# Altium project AMSController.PrjPcb
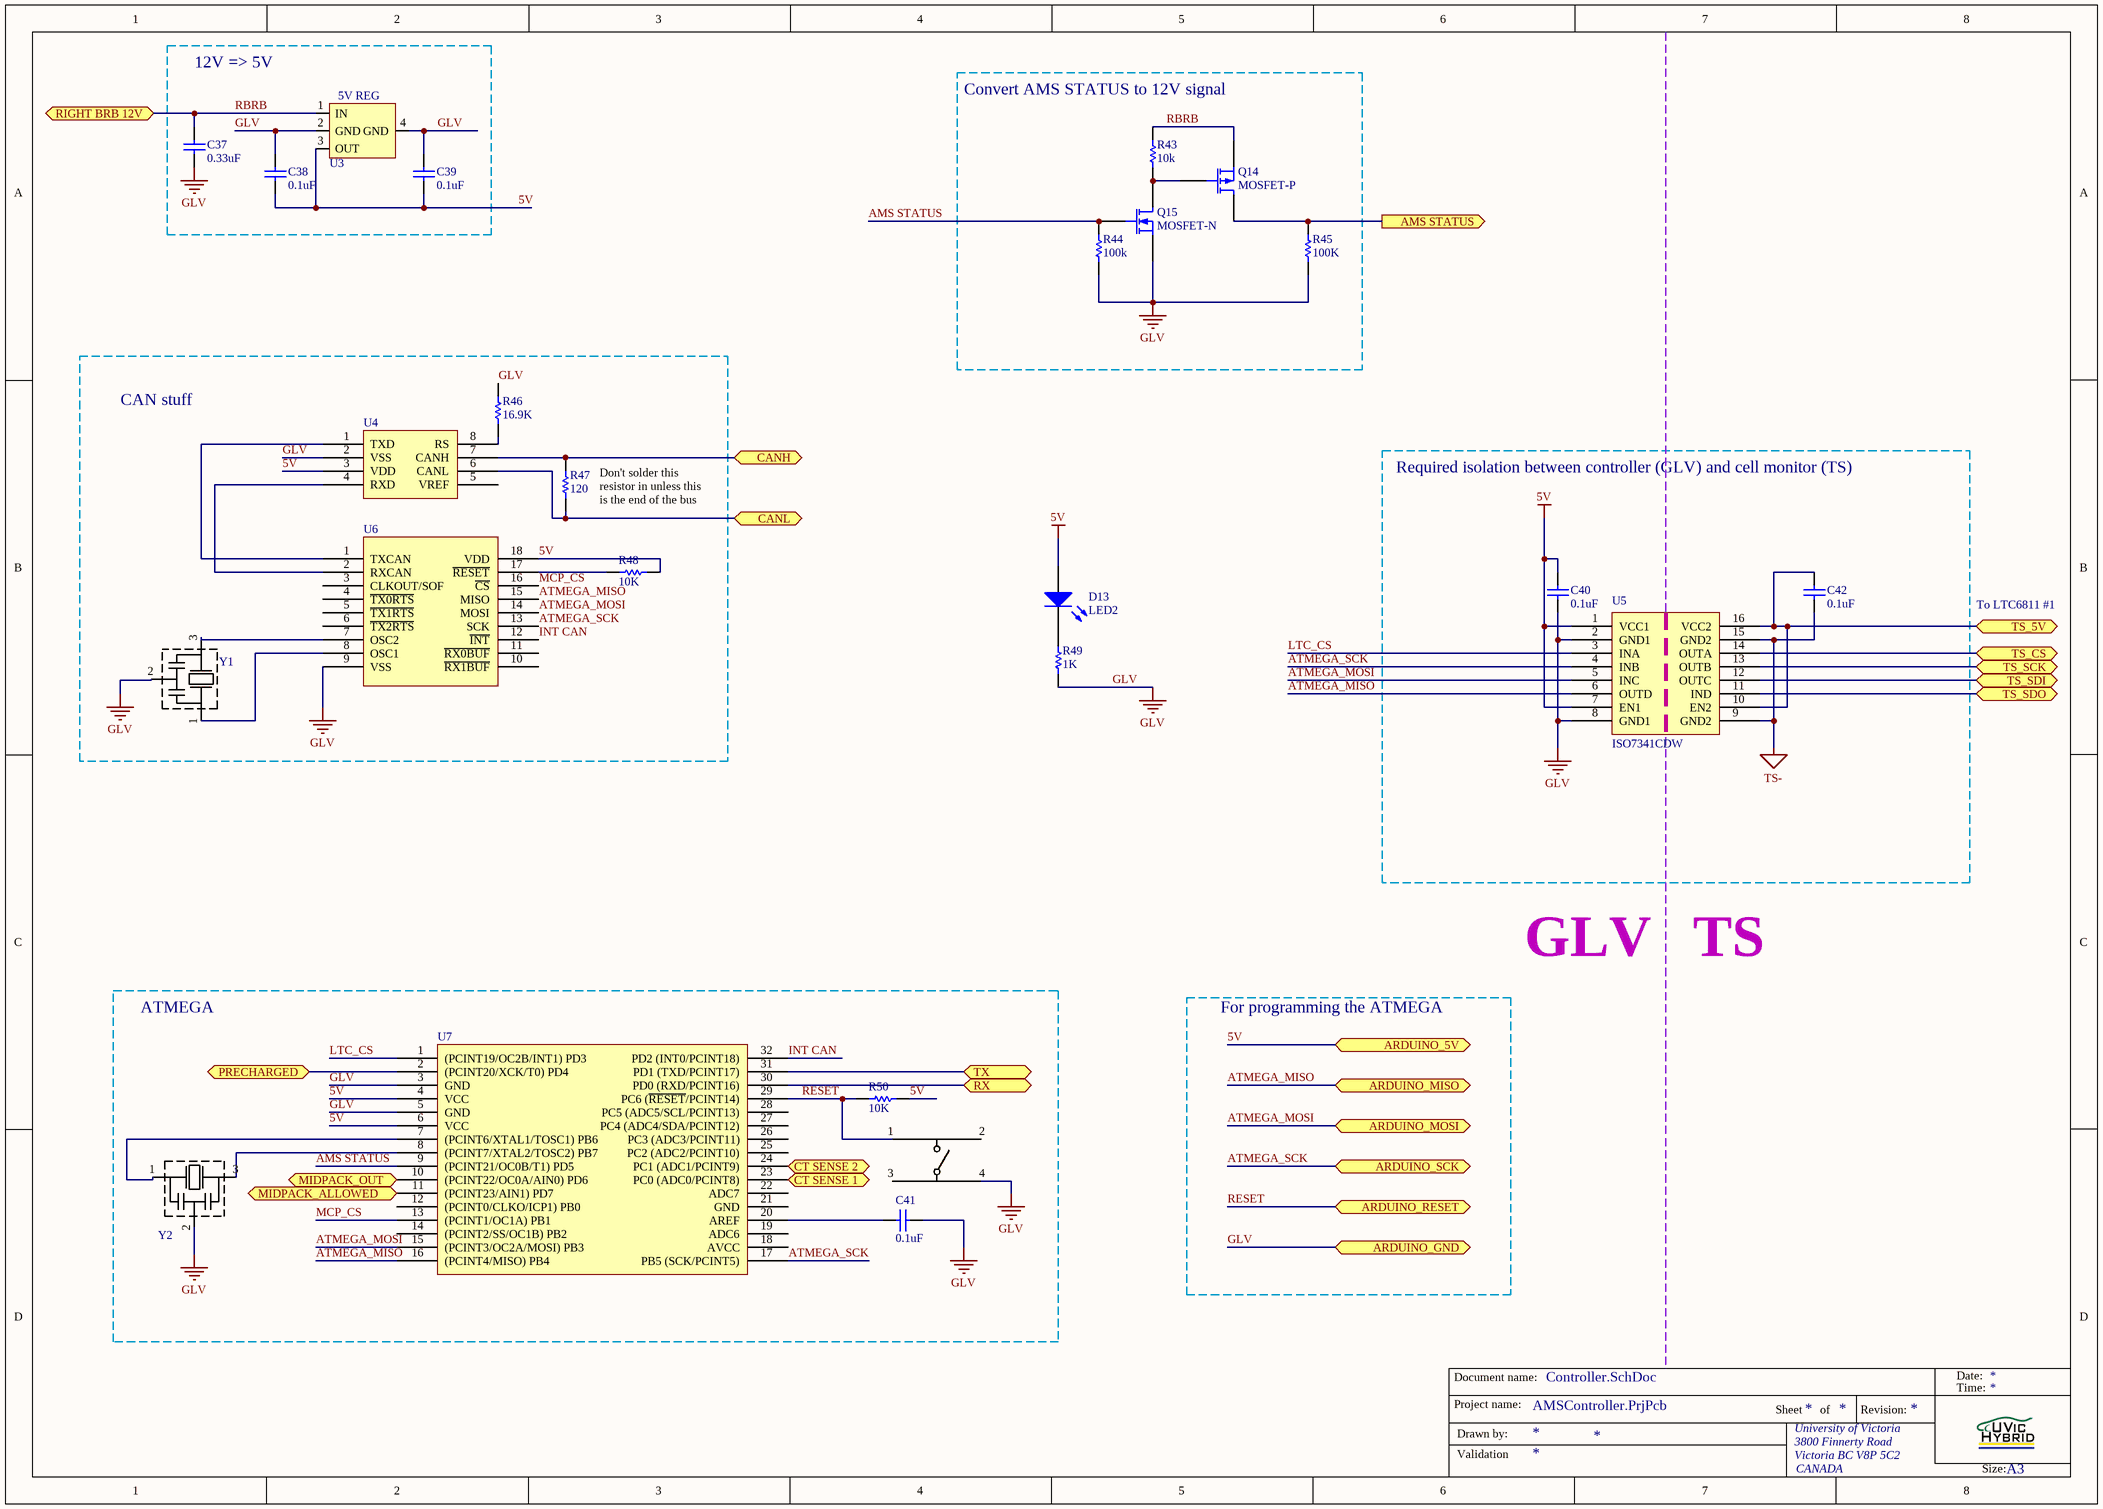
[diagram p0: Controller.SchDoc]
3 sheets, 151 parts. Net scope: flat (ports and power ports of the same name join across sheets).
Board file: AMSController.PcbDoc
Sheets:
  Controller.SchDoc
  IO.SchDoc
  CellMonitor1.SchDoc

## Sheet Controller.SchDoc
size A3

### Parts
C37  0.33uF  [C1206]
C38  0.1uF  [0603 IMPERIAL]
C39  0.1uF  [0603 IMPERIAL]
C40  0.1uF  [0603 IMPERIAL]
C41  0.1uF  [0603 IMPERIAL]
C42  0.1uF  [0603 IMPERIAL]
D13  LED2  [3.2X1.6X1.1]
Q14  MOSFET-P  [SOT23f]
Q15  MOSFET-N  [SOT23f]
R43  10k  [0603 IMPERIAL]
R44  100k  [0603 IMPERIAL]
R45  100K  [0603 IMPERIAL]
R46  16.9K  [0603 IMPERIAL]
R47  120  [0603 IMPERIAL]
R48  10K  [0603 IMPERIAL]
R49  1K  [0603 IMPERIAL]
R50  10K  [0603 IMPERIAL]
SW1  PTS525SM15SMTR2  [PTS525SM15SMTR2]  (value not drawn)
U3  UA7805CKTTR  [SOT223]  (value not drawn)
U4  MCP2551-E/SN  [SOIC127P600X175-8M]  (value not drawn)
U5  ISO7341CDW  [SOIC16-WB]
U6  MCP2515-E/ST  [SOIC127P1030X265-18M]  (value not drawn)
U7  ATMEGA328P  [ATMEGA328P-15AZ - 2]  (value not drawn)
Y1  CSTCE16M0V53-R0  [CSTCE16M0V53-R0]  (value not drawn)
Y2  CSTCE16M0V53-R0  [CSTCE16M0V53-R0]  (value not drawn)

### Blocks framed on the sheet
12V => 5V: C37-C39 U3
Convert AMS STATUS to 12V signal: Q14 Q15 R43-R45
CAN stuff: R46-R48 U4 U6 Y1
ATMEGA: C41 R50 SW1 U7 Y2

### Ports
AMS STATUS (out), ARDUINO_5V, ARDUINO_GND, ARDUINO_MISO, ARDUINO_MOSI, ARDUINO_RESET, ARDUINO_SCK, CANH, CANL, CT SENSE 1, CT SENSE 2, MIDPACK_ALLOWED, MIDPACK_OUT, PRECHARGED, RIGHT BRB 12V, RX, TS_5V, TS_CS, TS_SCK, TS_SDI, TS_SDO, TX

### Nets
5V: C38.1 C39.1 C40.2 D13.1(A) R48.2 R50.2 U3.3(OUT) U4.3(VDD) U5.1(VCC1) U5.7(EN1) U6.18(VDD) U7.4(VCC) U7.6(VCC) ; port ARDUINO_5V
GLV: C37.1 C38.2 C39.2 C40.1 C41.2 Q15.3(S) R44.1 R45.1 R46.2 R49.1 SW1.4 U3.2(GND) U3.4(GND) U4.2(VSS) U5.2(GND1) U5.8(GND1) U6.9(VSS) U7.3(GND) U7.5(GND) Y1.2 Y2.2 ; port ARDUINO_GND
TS-: C42.1 U5.9(GND2) U5.15(GND2)
AMS STATUS: Q15.2(G) R44.2 U7.9((PCINT21/OC0B/T1)_PD5)
ATMEGA_MISO: U5.6(OUTD) U6.15(MISO) U7.16((PCINT4/MISO)_PB4) ; port ARDUINO_MISO
ATMEGA_MOSI: U5.5(INC) U6.14(MOSI) U7.15((PCINT3/OC2A/MOSI)_PB3) ; port ARDUINO_MOSI
ATMEGA_SCK: U5.4(INB) U6.13(SCK) U7.17(PB5_(SCK/PCINT5)) ; port ARDUINO_SCK
CAN_N: R47.1 U4.6(CANL) ; port CANL
CAN_P: R47.2 U4.7(CANH) ; port CANH
CS: U5.14(OUTA) ; port TS_CS
INT CAN: U6.12(~{INT}) U7.32(PD2_(INT0/PCINT18))
LTC_CS: U5.3(INA) U7.1((PCINT19/OC2B/INT1)_PD3)
MCP_CS: U6.16(~{CS}) U7.13((PCINT1/OC1A)_PB1)
RBRB: C37.2 Q14.3(S) R43.2 U3.1(IN) ; port RIGHT BRB 12V
RESET: R50.1 SW1.1 U7.29(PC6_(~{RESET}/PCINT14)) ; port ARDUINO_RESET
SCK: U5.13(OUTB) ; port TS_SCK
SDI: U5.12(OUTC) ; port TS_SDI
SDO: U5.11(IND) ; port TS_SDO
TS_5V: C42.2 U5.10(EN2) U5.16(VCC2) ; port TS_5V
NetC41_1: C41.1 U7.20(AREF)
NetD13_2: D13.2(K) R49.2
NetP2_1: U7.2((PCINT20/XCK/T0)_PD4) ; port PRECHARGED
NetP2_2: U7.10((PCINT22/OC0A/AIN0)_PD6) ; port MIDPACK_OUT
NetP2_3: U7.11((PCINT23/AIN1)_PD7) ; port MIDPACK_ALLOWED
NetP6_6: U7.24(PC1_(ADC1/PCINT9)) ; port CT SENSE 2
NetP6_7: U7.23(PC0_(ADC0/PCINT8)) ; port CT SENSE 1
NetP6_10: Q14.1(D) R45.2 ; port AMS STATUS
NetP7_1: U7.31(PD1_(TXD/PCINT17)) ; port TX
NetP7_2: U7.30(PD0_(RXD/PCINT16)) ; port RX
NetQ14_2: Q14.2(G) Q15.1(D) R43.1
NetR46_1: R46.1 U4.8(RS)
NetR48_1: R48.1 U6.17(~{RESET})
NetU4_1: U4.1(TXD) U6.1(TXCAN)
NetU4_4: U4.4(RXD) U6.2(RXCAN)
NetU6_7: U6.7(OSC2) Y1.3
NetU6_8: U6.8(OSC1) Y1.1
NetU7_7: U7.7((PCINT6/XTAL1/TOSC1)_PB6) Y2.1
NetU7_8: U7.8((PCINT7/XTAL2/TOSC2)_PB7) Y2.3

Not connected (* = marked no-connect by the designer): SW1 2 3; U4 5(VREF); U6 3(CLKOUT/SOF) 4(~{TX0RTS}) 5(~{TX1RTS}) 6(~{TX2RTS}) 10(~{RX1BUF}) 11(~{RX0BUF}); U7 12((PCINT0/CLKO/ICP1)_PB0) 14((PCINT2/SS/OC1B)_PB2) 18(AVCC) 19(ADC6) 21(GND) 22(ADC7) 25(PC2_(ADC2/PCINT10)) 26(PC3_(ADC3/PCINT11)) 27(PC4_(ADC4/SDA/PCINT12)) 28(PC5_(ADC5/SCL/PCINT13))

### Notes on the sheet
- (near R47) Don't solder this resistor in unless this is the end of the bus
- Required isolation between controller (GLV) and cell monitor (TS)
- To LTC6811 #1
- GLV
- TS
- For programming the ATMEGA
- Document name:
- Date:
- Time:
- Project name:
- Drawn by:
- Validation
- Sheet
- University of Victoria
- 3800 Finnerty Road
- Victoria BC V8P 5C2
- of
- Revision:
- CANADA
- Size:
- A3
- (in symbol UA7805CKTTR) 5V REG

### Library data of the parts
C37 = Cap Semi: Capacitor (Semiconductor SIM Model); Published: 8-Jun-2000; LatestRevisionDate: 29-May-2009; LatestRevisionNote: IPC-7351 Footprint Added.; PackageReference: C1206; Publisher: Altium Limited; PackageDescription: Chip Capacitor; Value: 0.33uF; Supplier Part Number: 445-4464-1-ND
C38-C42 = Cap: Capacitor; Published: 8-Jun-2000; LatestRevisionDate: 17-Jul-2002; LatestRevisionNote: Re-released for DXP Platform.; Publisher: Altium Limited; Value: 0.1uF; Supplier Part Number: 399-1095-1-ND
D13 = LED2: Typical RED, GREEN, YELLOW, AMBER GaAs LED; Published: 8-Jun-2000; LatestRevisionDate: 17-Jul-2002; LatestRevisionNote: Re-released for DXP Platform.; PackageVersion: Feb-2002; PackageReference: 3.2X1.6X1.1; Publisher: Altium Limited; PackageDescription: SM LED; 2 Flat Leads; Supplier Part Number: 160-1456-1-ND
Q14 = MOSFET-P: P-Channel MOSFET; Published: 8-Jun-2000; LatestRevisionDate: 17-Jul-2002; LatestRevisionNote: Re-released for DXP Platform.; PackageVersion: 1995/1996; PackageReference: E3; Publisher: Altium Limited; PackageDescription: TO, Flat Index; 3 In-Line, Axial Leads; Body Dia. 4.6mm; Lead Dia. 0.5 mm (max); Supplier Part Number: BSS308PE H6327CT-ND
Q15 = MOSFET-N: N-Channel MOSFET; Published: 8-Jun-2000; LatestRevisionDate: 17-Jul-2002; LatestRevisionNote: Re-released for DXP Platform.; PackageVersion: 1995/1996; PackageReference: E3; Publisher: Altium Limited; PackageDescription: TO, Flat Index; 3 In-Line, Axial Leads; Body Dia. 4.6mm; Lead Dia. 0.5 mm (max); Supplier Part Number: DMN3404LDICT-ND
R43 R45-R50 = Res1: Resistor
  R43 R48 R50: Value: 10K; Supplier Part Number: MCT0603-10.0K-CFCT-ND
  R45: Value: 100K; Supplier Part Number: RR08P100KDCT-ND
  R46: Value: 16.9K; Supplier Part Number: P16.9KDBCT-ND
  R47: Value: 120; Supplier Part Number: 311-120HRCT-ND
  R49: Value: 1K; Supplier Part Number: 311-1.0KGRCT-ND
R44 = Res1: Resistor; Value: 10K; Supplier Part Number: RR08P100KDCT-ND
U3 = UA7805CKTTR: 12V to 5V LDO; Supplier Part Number: 296-12290-6-ND
U4 = MCP2551-E/SN: SOIC; Supplier Part Number: MCP2551-E/SN-ND
U6 = MCP2515-E/ST: SOIC; Supplier Part Number: MCP2515-I/SO-ND
U7 = ATMEGA328P: TQFN; Supplier 1: Digi-Key; Supplier Part Number: ATMEGA328P-AU-ND
SW1 = PTS525SM15SMTR2: Supplier 1: Digi-Key; Supplier Part Number: CKN9104CT-ND
Y1 Y2 = CSTCE16M0V53-R0: Supplier Part Number: 490-1198-1-ND

## Sheet IO.SchDoc
size A4
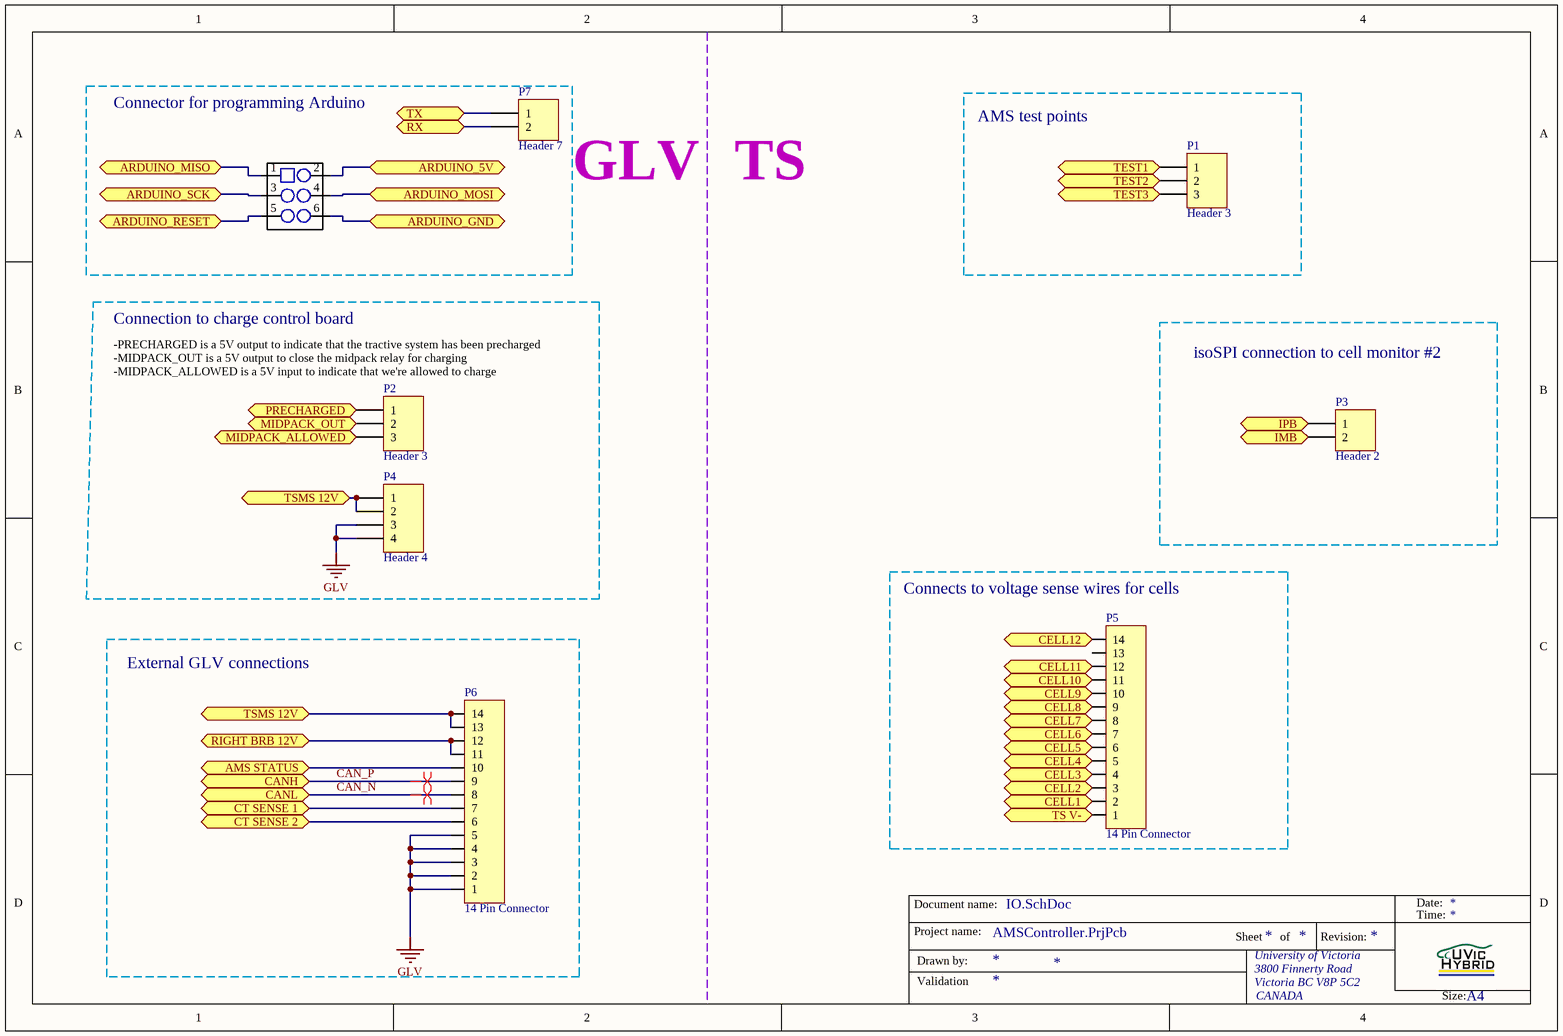
[diagram p1: IO.SchDoc]

### Parts
1  ICSP Connector  [ICSP Connector]  (value not drawn)
P1  Header 3  [3-pin Vertical nanofit]
P2  Header 3  [3-pin Vertical nanofit]
P3  Header 2  [2 Pin Nanofit]
P4  Header 4  [4 Pin Vertical Nanofit]
P5  14 Pin Connector  [TE Connectivity 14 Pin]
P6  14 Pin Connector  [TE Connectivity 14 Pin]
P7  Header 7  [2 Pin Nanofit]

### Blocks framed on the sheet
Connector for programming Arduino: 1 P7
AMS test points: P1
Connection to charge control board: P2 P4
isoSPI connection to cell monitor #2: P3
Connects to voltage sense wires for cells: P5
External GLV connections: P6

### Ports
AMS STATUS, ARDUINO_5V, ARDUINO_GND, ARDUINO_MISO, ARDUINO_MOSI, ARDUINO_RESET, ARDUINO_SCK, CANH, CANL, CELL1, CELL2, CELL3, CELL4, CELL5, CELL6, CELL7, CELL8, CELL9, CELL10, CELL11, CELL12, CT SENSE 1, CT SENSE 2, IMB, IPB, MIDPACK_ALLOWED, MIDPACK_OUT, PRECHARGED, RIGHT BRB 12V, RX, TEST1, TEST2, TEST3, TS V-, TSMS 12V, TX

### Nets
5V: 1.2 ; port ARDUINO_5V
GLV: 1.6 P4.3 P4.4 P6.1 P6.2 P6.3 P6.4 P6.5 ; port ARDUINO_GND
TS-: P5.1 ; port TS V-
ATMEGA_MISO: 1.1 ; port ARDUINO_MISO
ATMEGA_MOSI: 1.4 ; port ARDUINO_MOSI
ATMEGA_SCK: 1.3 ; port ARDUINO_SCK
CAN_N: P6.8 ; port CANL
CAN_P: P6.9 ; port CANH
RBRB: P6.11 P6.12 ; port RIGHT BRB 12V
RESET: 1.5 ; port ARDUINO_RESET
NetC3_2: P1.3 ; port TEST3
NetC5_2: P1.1 ; port TEST1
NetF1_1: P5.14 ; port CELL12
NetF2_1: P5.12 ; port CELL11
NetF3_1: P5.11 ; port CELL10
NetF4_1: P5.10 ; port CELL9
NetF5_1: P5.9 ; port CELL8
NetF6_1: P5.8 ; port CELL7
NetF7_1: P5.7 ; port CELL6
NetF8_1: P5.6 ; port CELL5
NetF9_1: P5.5 ; port CELL4
NetF10_1: P5.4 ; port CELL3
NetF11_1: P5.3 ; port CELL2
NetF12_1: P5.2 ; port CELL1
NetP1_2: P1.2 ; port TEST2
NetP2_1: P2.1 ; port PRECHARGED
NetP2_2: P2.2 ; port MIDPACK_OUT
NetP2_3: P2.3 ; port MIDPACK_ALLOWED
NetP3_1: P3.1 ; port IPB
NetP3_2: P3.2 ; port IMB
NetP4_1: P4.1 P4.2 P6.13 P6.14 ; port TSMS 12V
NetP6_6: P6.6 ; port CT SENSE 2
NetP6_7: P6.7 ; port CT SENSE 1
NetP6_10: P6.10 ; port AMS STATUS
NetP7_1: P7.1 ; port TX
NetP7_2: P7.2 ; port RX

Not connected (* = marked no-connect by the designer): P5 13

### Layout directives
differential pair: CAN_N, CAN_P

### Notes on the sheet
- GLV
- TS
- (near P2) -PRECHARGED is a 5V output to indicate that the tractive system has been precharged
  -MIDPACK_OUT is a 5V output to close the midpack relay for charging
  -MIDPACK_ALLOWED is a 5V input to indicate that we're allowed to charge
- Document name:
- Date:
- Time:
- Project name:
- Drawn by:
- Validation
- Sheet
- University of Victoria
- 3800 Finnerty Road
- Victoria BC V8P 5C2
- of
- Revision:
- CANADA
- Size:
- A4

### Library data of the parts
P1 P2 = Header 3: Header, 3-Pin; LatestRevisionDate: 17-Jul-2002; LatestRevisionNote: Re-released for DXP Platform.; Publisher: Altium Limited
P3 P7 = Header 2: Header, 2-Pin; LatestRevisionDate: 17-Jul-2002; LatestRevisionNote: Re-released for DXP Platform.; Publisher: Altium Limited
P4 = Header 4: Header, 4-Pin; LatestRevisionDate: 17-Jul-2002; LatestRevisionNote: Re-released for DXP Platform.; Publisher: Altium Limited
1 = ICSP Connector: Supplier Part Number: 952-2121-ND
P5 P6 = 14 Pin Connector: Supplier Part Number: A32482-ND

## Sheet CellMonitor1.SchDoc
size A2
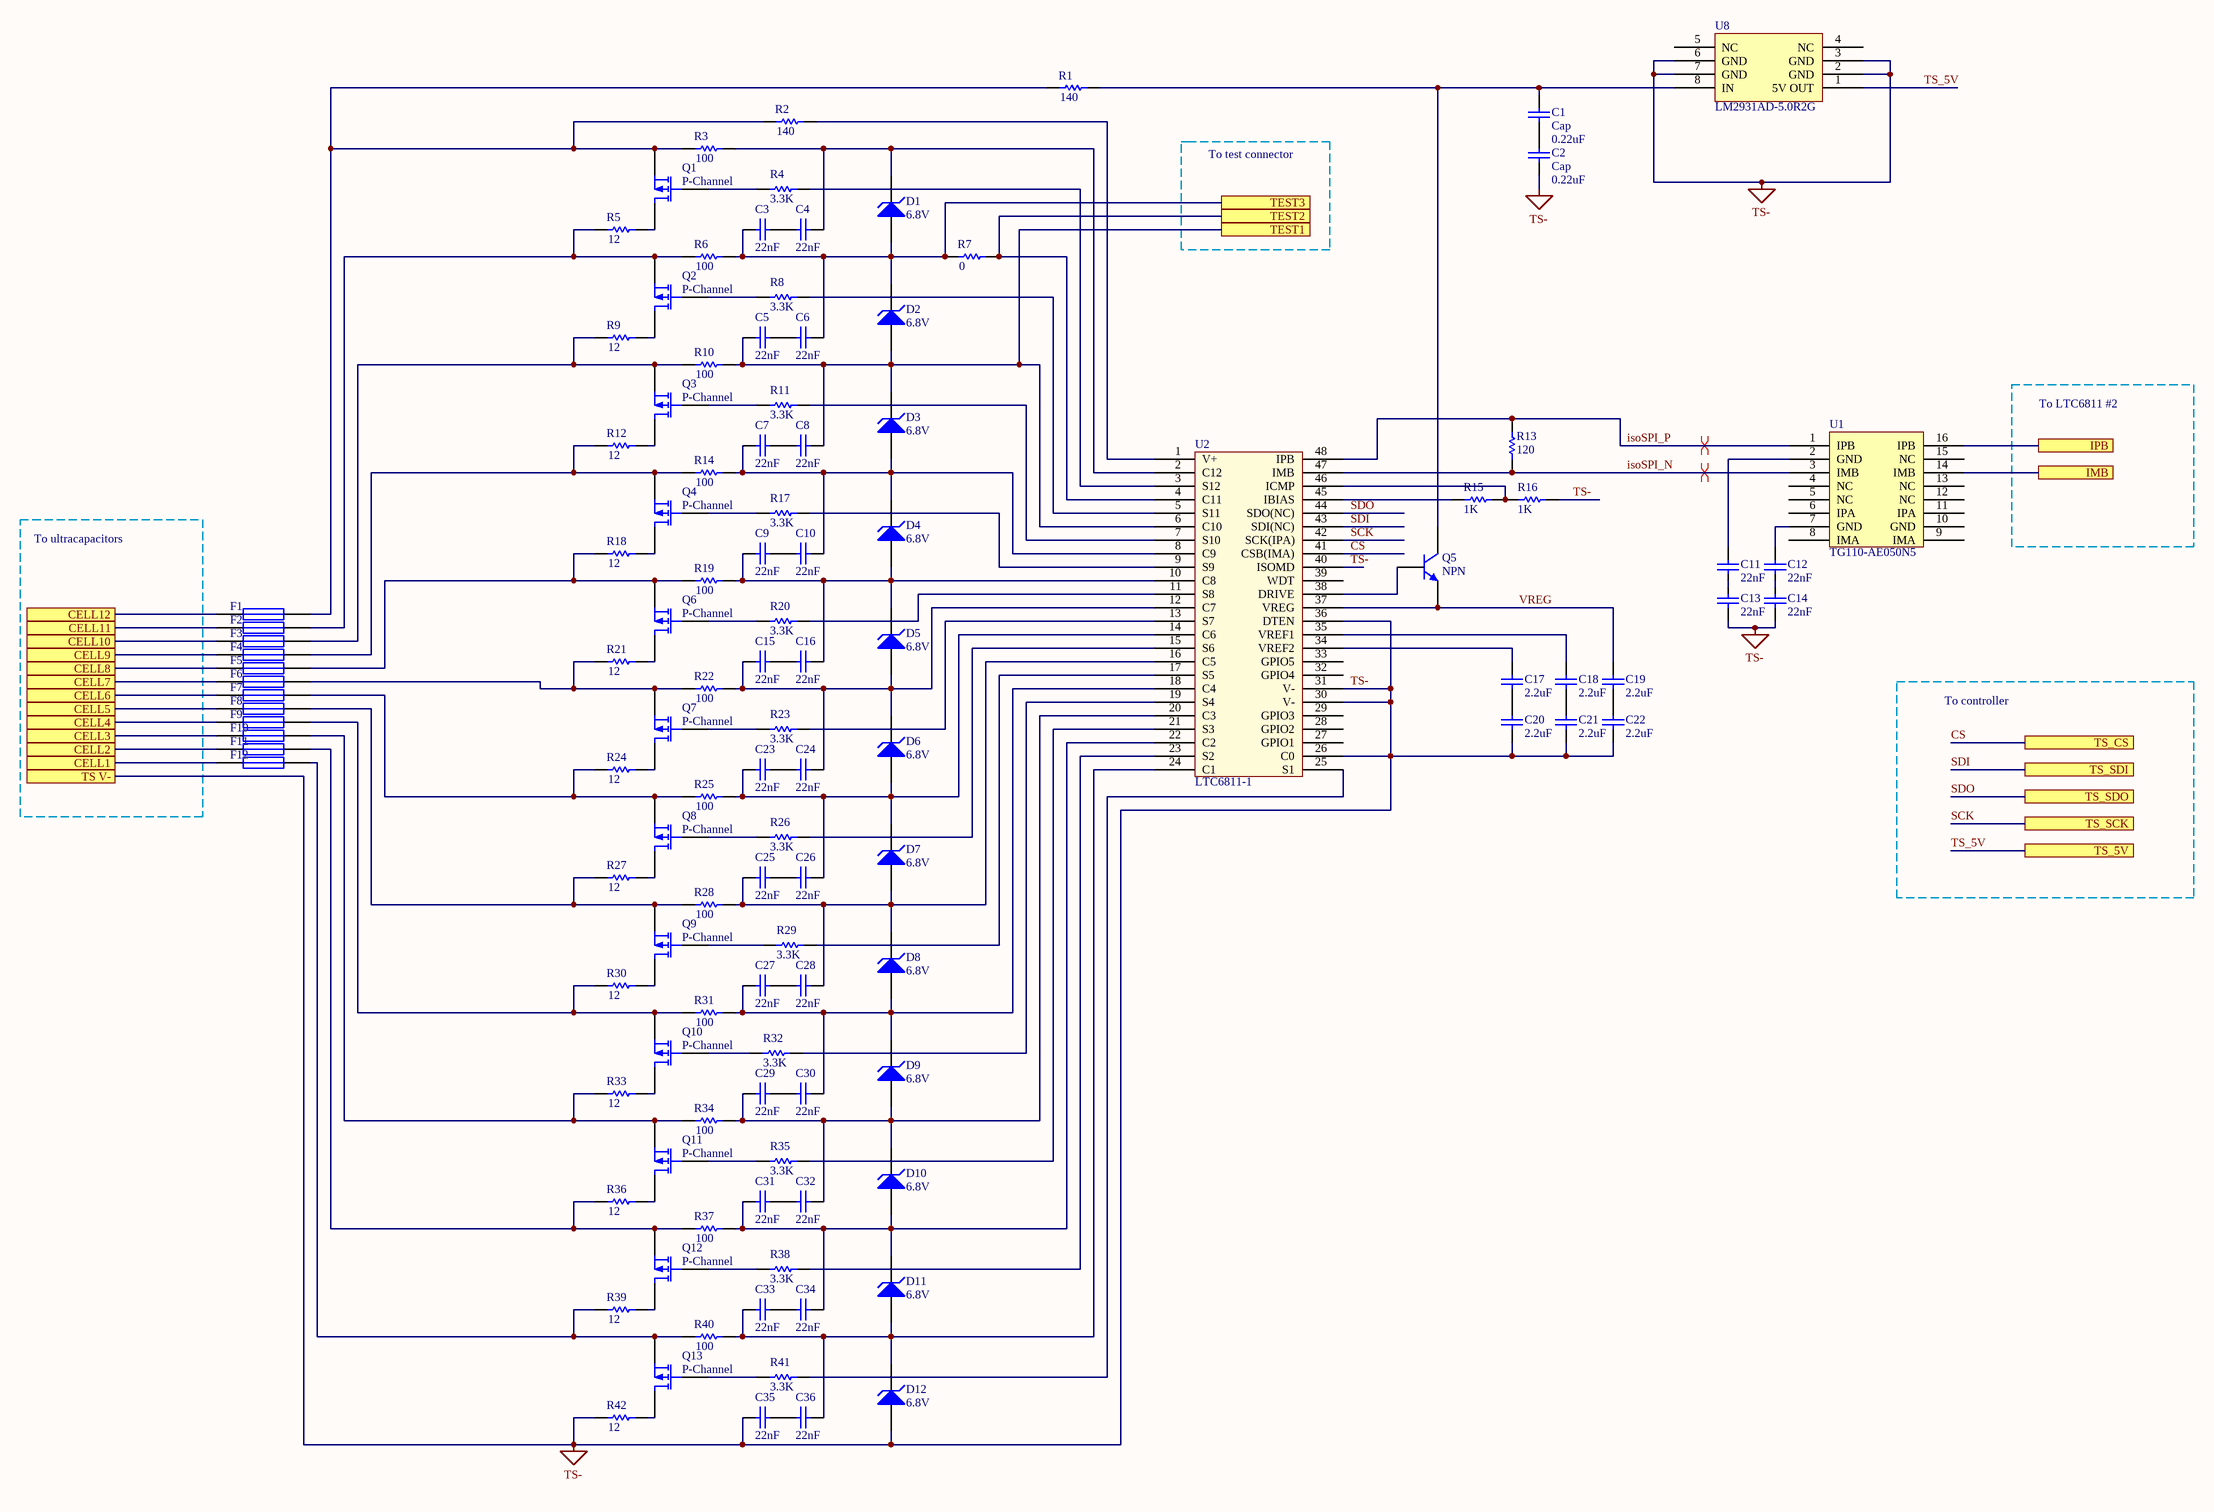
[diagram p2: CellMonitor1.SchDoc]

### Parts
C1  Cap  value 0.22uF  [0603 IMPERIAL]
C2  Cap  value 0.22uF  [0603 IMPERIAL]
C3  value 22nF  [0603 IMPERIAL]  (hidden comment: Cap)
C4  value 22nF  [0603 IMPERIAL]  (hidden comment: Cap)
C5  value 22nF  [0603 IMPERIAL]  (hidden comment: Cap)
C6  value 22nF  [0603 IMPERIAL]  (hidden comment: Cap)
C7  value 22nF  [0603 IMPERIAL]  (hidden comment: Cap)
C8  value 22nF  [0603 IMPERIAL]  (hidden comment: Cap)
C9  value 22nF  [0603 IMPERIAL]  (hidden comment: Cap)
C10  value 22nF  [0603 IMPERIAL]  (hidden comment: Cap)
C11  value 22nF  [0603 IMPERIAL]  (hidden comment: Cap)
C12  value 22nF  [0603 IMPERIAL]  (hidden comment: Cap)
C13  value 22nF  [0603 IMPERIAL]  (hidden comment: Cap)
C14  value 22nF  [0603 IMPERIAL]  (hidden comment: Cap)
C15  value 22nF  [0603 IMPERIAL]  (hidden comment: Cap)
C16  value 22nF  [0603 IMPERIAL]  (hidden comment: Cap)
C17  value 2.2uF  [0603 IMPERIAL]  (hidden comment: Cap)
C18  value 2.2uF  [0603 IMPERIAL]  (hidden comment: Cap)
C19  value 2.2uF  [0603 IMPERIAL]  (hidden comment: Cap)
C20  value 2.2uF  [0603 IMPERIAL]  (hidden comment: Cap)
C21  value 2.2uF  [0603 IMPERIAL]  (hidden comment: Cap)
C22  value 2.2uF  [0603 IMPERIAL]  (hidden comment: Cap)
C23  value 22nF  [0603 IMPERIAL]  (hidden comment: Cap)
C24  value 22nF  [0603 IMPERIAL]  (hidden comment: Cap)
C25  value 22nF  [0603 IMPERIAL]  (hidden comment: Cap)
C26  value 22nF  [0603 IMPERIAL]  (hidden comment: Cap)
C27  value 22nF  [0603 IMPERIAL]  (hidden comment: Cap)
C28  value 22nF  [0603 IMPERIAL]  (hidden comment: Cap)
C29  value 22nF  [0603 IMPERIAL]  (hidden comment: Cap)
C30  value 22nF  [0603 IMPERIAL]  (hidden comment: Cap)
C31  value 22nF  [0603 IMPERIAL]  (hidden comment: Cap)
C32  value 22nF  [0603 IMPERIAL]  (hidden comment: Cap)
C33  value 22nF  [0603 IMPERIAL]  (hidden comment: Cap)
C34  value 22nF  [0603 IMPERIAL]  (hidden comment: Cap)
C35  value 22nF  [0603 IMPERIAL]  (hidden comment: Cap)
C36  value 22nF  [0603 IMPERIAL]  (hidden comment: Cap)
D1  6.8V  [SOD-323]
D2  6.8V  [SOD-323]
D3  6.8V  [SOD-323]
D4  6.8V  [SOD-323]
D5  6.8V  [SOD-323]
D6  6.8V  [SOD-323]
D7  6.8V  [SOD-323]
D8  6.8V  [SOD-323]
D9  6.8V  [SOD-323]
D10  6.8V  [SOD-323]
D11  6.8V  [SOD-323]
D12  6.8V  [SOD-323]
F1  0451.500NRL  [0451.500NRL]  (value not drawn)
F2  0451.500NRL  [0451.500NRL]  (value not drawn)
F3  0451.500NRL  [0451.500NRL]  (value not drawn)
F4  0451.500NRL  [0451.500NRL]  (value not drawn)
F5  0451.500NRL  [0451.500NRL]  (value not drawn)
F6  0451.500NRL  [0451.500NRL]  (value not drawn)
F7  0451.500NRL  [0451.500NRL]  (value not drawn)
F8  0451.500NRL  [0451.500NRL]  (value not drawn)
F9  0451.500NRL  [0451.500NRL]  (value not drawn)
F10  0451.500NRL  [0451.500NRL]  (value not drawn)
F11  0451.500NRL  [0451.500NRL]  (value not drawn)
F12  0451.500NRL  [0451.500NRL]  (value not drawn)
Q1  P-Channel  [SOT23F]
Q2  P-Channel  [SOT23F]
Q3  P-Channel  [SOT23F]
Q4  P-Channel  [SOT23F]
Q5  NPN  [SOT223_N]
Q6  P-Channel  [SOT23F]
Q7  P-Channel  [SOT23F]
Q8  P-Channel  [SOT23F]
Q9  P-Channel  [SOT23F]
Q10  P-Channel  [SOT23F]
Q11  P-Channel  [SOT23F]
Q12  P-Channel  [SOT23F]
Q13  P-Channel  [SOT23F]
R1  value 140  [0603 IMPERIAL]  (hidden comment: Res1)
R2  value 140  [0603 IMPERIAL]  (hidden comment: Res1)
R3  value 100  [0603 IMPERIAL]  (hidden comment: Res1)
R4  value 3.3K  [0603 IMPERIAL]  (hidden comment: Res1)
R5  value 12  [2512 IMPERIAL]  (hidden comment: Res1)
R6  value 100  [0603 IMPERIAL]  (hidden comment: Res1)
R7  value 0  [0603 IMPERIAL]  (hidden comment: Res1)
R8  value 3.3K  [0603 IMPERIAL]  (hidden comment: Res1)
R9  value 12  [2512 IMPERIAL]  (hidden comment: Res1)
R10  value 100  [0603 IMPERIAL]  (hidden comment: Res1)
R11  value 3.3K  [0603 IMPERIAL]  (hidden comment: Res1)
R12  value 12  [2512 IMPERIAL]  (hidden comment: Res1)
R13  120  [0603 IMPERIAL]
R14  value 100  [0603 IMPERIAL]  (hidden comment: Res1)
R15  1K  [0603 IMPERIAL]
R16  1K  [0603 IMPERIAL]
R17  value 3.3K  [0603 IMPERIAL]  (hidden comment: Res1)
R18  value 12  [2512 IMPERIAL]  (hidden comment: Res1)
R19  value 100  [0603 IMPERIAL]  (hidden comment: Res1)
R20  value 3.3K  [0603 IMPERIAL]  (hidden comment: Res1)
R21  value 12  [2512 IMPERIAL]  (hidden comment: Res1)
R22  value 100  [0603 IMPERIAL]  (hidden comment: Res1)
R23  value 3.3K  [0603 IMPERIAL]  (hidden comment: Res1)
R24  value 12  [2512 IMPERIAL]  (hidden comment: Res1)
R25  value 100  [0603 IMPERIAL]  (hidden comment: Res1)
R26  value 3.3K  [0603 IMPERIAL]  (hidden comment: Res1)
R27  value 12  [2512 IMPERIAL]  (hidden comment: Res1)
R28  value 100  [0603 IMPERIAL]  (hidden comment: Res1)
R29  value 3.3K  [0603 IMPERIAL]  (hidden comment: Res1)
R30  value 12  [2512 IMPERIAL]  (hidden comment: Res1)
R31  value 100  [0603 IMPERIAL]  (hidden comment: Res1)
R32  value 3.3K  [0603 IMPERIAL]  (hidden comment: Res1)
R33  value 12  [2512 IMPERIAL]  (hidden comment: Res1)
R34  value 100  [0603 IMPERIAL]  (hidden comment: Res1)
R35  value 3.3K  [0603 IMPERIAL]  (hidden comment: Res1)
R36  value 12  [2512 IMPERIAL]  (hidden comment: Res1)
R37  value 100  [0603 IMPERIAL]  (hidden comment: Res1)
R38  value 3.3K  [0603 IMPERIAL]  (hidden comment: Res1)
R39  value 12  [2512 IMPERIAL]  (hidden comment: Res1)
R40  value 100  [0603 IMPERIAL]  (hidden comment: Res1)
R41  value 3.3K  [0603 IMPERIAL]  (hidden comment: Res1)
R42  value 12  [2512 IMPERIAL]  (hidden comment: Res1)
U1  TG110-AE050N5  [Halo N5]
U2  LTC6811-1  [SSOP-48]
U8  LM2931AD-5.0R2G  [8-SOIC]

### Ports
CELL1, CELL2, CELL3, CELL4, CELL5, CELL6, CELL7, CELL8, CELL9, CELL10, CELL11, CELL12, IMB, IPB, TEST1, TEST2, TEST3, TS V-, TS_5V, TS_CS, TS_SCK, TS_SDI, TS_SDO

### Nets
TS-: C2.2 C13.2 C14.2 C20.2 C21.2 C22.2 C35.2 D12.1(A) R16.2 R42.1 U2.26(C0) U2.30(V-) U2.31(V-) U2.36(DTEN) U2.40(ISOMD) U8.2(GND) U8.3(GND) U8.6(GND) U8.7(GND) ; port TS V-
CS: U2.41(CSB(IMA)) ; port TS_CS
isoSPI_N: R13.1 U1.3(IMB) U2.47(IMB)
isoSPI_P: R13.2 U1.1(IPB) U2.48(IPB)
SCK: U2.42(SCK(IPA)) ; port TS_SCK
SDI: U2.43(SDI(NC)) ; port TS_SDI
SDO: U2.44(SDO(NC)) ; port TS_SDO
TS_5V: U8.1(5V_OUT) ; port TS_5V
VREG: C19.1 Q5.3(E) U2.37(VREG)
NetC1_1: C1.1 Q5.2(C) R1.2 U8.8(IN)
NetC1_2: C1.2 C2.1
NetC3_1: C3.1 C4.2
NetC3_2: C3.2 C6.1 D1.1(A) D2.2(K) R6.2 R7.1 ; port TEST3
NetC4_1: C4.1 D1.2(K) R3.2 U2.2(C12)
NetC5_1: C5.1 C6.2
NetC5_2: C5.2 C8.1 D2.1(A) D3.2(K) R10.2 U2.6(C10) ; port TEST1
NetC7_1: C7.1 C8.2
NetC7_2: C7.2 C10.1 D3.1(A) D4.2(K) R14.2 U2.8(C9)
NetC9_1: C9.1 C10.2
NetC9_2: C9.2 C16.1 D4.1(A) D5.2(K) R19.2 U2.10(C8)
NetC11_1: C11.1 U1.2(GND)
NetC11_2: C11.2 C13.1
NetC12_1: C12.1 U1.7(GND)
NetC12_2: C12.2 C14.1
NetC15_1: C15.1 C16.2
NetC15_2: C15.2 C24.1 D5.1(A) D6.2(K) R22.2 U2.12(C7)
NetC17_1: C17.1 U2.34(VREF2)
NetC17_2: C17.2 C20.1
NetC18_1: C18.1 U2.35(VREF1)
NetC18_2: C18.2 C21.1
NetC19_2: C19.2 C22.1
NetC23_1: C23.1 C24.2
NetC23_2: C23.2 C26.1 D6.1(A) D7.2(K) R25.2 U2.14(C6)
NetC25_1: C25.1 C26.2
NetC25_2: C25.2 C28.1 D7.1(A) D8.2(K) R28.2 U2.16(C5)
NetC27_1: C27.1 C28.2
NetC27_2: C27.2 C30.1 D8.1(A) D9.2(K) R31.2 U2.18(C4)
NetC29_1: C29.1 C30.2
NetC29_2: C29.2 C32.1 D9.1(A) D10.2(K) R34.2 U2.20(C3)
NetC31_1: C31.1 C32.2
NetC31_2: C31.2 C34.1 D10.1(A) D11.2(K) R37.2 U2.22(C2)
NetC33_1: C33.1 C34.2
NetC33_2: C33.2 C36.1 D11.1(A) D12.2(K) R40.2 U2.24(C1)
NetC35_1: C35.1 C36.2
NetF1_1: F1.1 ; port CELL12
NetF1_2: F1.2 Q1.3(S) R1.1 R2.1 R3.1
NetF2_1: F2.1 ; port CELL11
NetF2_2: F2.2 Q2.3(S) R5.1 R6.1
NetF3_1: F3.1 ; port CELL10
NetF3_2: F3.2 Q3.3(S) R9.1 R10.1
NetF4_1: F4.1 ; port CELL9
NetF4_2: F4.2 Q4.3(S) R12.1 R14.1
NetF5_1: F5.1 ; port CELL8
NetF5_2: F5.2 Q6.3(S) R18.1 R19.1
NetF6_1: F6.1 ; port CELL7
NetF6_2: F6.2 Q7.3(S) R21.1 R22.1
NetF7_1: F7.1 ; port CELL6
NetF7_2: F7.2 Q8.3(S) R24.1 R25.1
NetF8_1: F8.1 ; port CELL5
NetF8_2: F8.2 Q9.3(S) R27.1 R28.1
NetF9_1: F9.1 ; port CELL4
NetF9_2: F9.2 Q10.3(S) R30.1 R31.1
NetF10_1: F10.1 ; port CELL3
NetF10_2: F10.2 Q11.3(S) R33.1 R34.1
NetF11_1: F11.1 ; port CELL2
NetF11_2: F11.2 Q12.3(S) R36.1 R37.1
NetF12_1: F12.1 ; port CELL1
NetF12_2: F12.2 Q13.3(S) R39.1 R40.1
NetP1_2: R7.2 U2.4(C11) ; port TEST2
NetP3_1: U1.16(IPB) ; port IPB
NetP3_2: U1.14(IMB) ; port IMB
NetQ1_1: Q1.1(D) R5.2
NetQ1_2: Q1.2(G) R4.1
NetQ2_1: Q2.1(D) R9.2
NetQ2_2: Q2.2(G) R8.1
NetQ3_1: Q3.1(D) R12.2
NetQ3_2: Q3.2(G) R11.1
NetQ4_1: Q4.1(D) R18.2
NetQ4_2: Q4.2(G) R17.1
NetQ5_1: Q5.1(B) U2.38(DRIVE)
NetQ6_1: Q6.1(D) R21.2
NetQ6_2: Q6.2(G) R20.1
NetQ7_1: Q7.1(D) R24.2
NetQ7_2: Q7.2(G) R23.1
NetQ8_1: Q8.1(D) R27.2
NetQ8_2: Q8.2(G) R26.1
NetQ9_1: Q9.1(D) R30.2
NetQ9_2: Q9.2(G) R29.1
NetQ10_1: Q10.1(D) R33.2
NetQ10_2: Q10.2(G) R32.1
NetQ11_1: Q11.1(D) R36.2
NetQ11_2: Q11.2(G) R35.1
NetQ12_1: Q12.1(D) R39.2
NetQ12_2: Q12.2(G) R38.1
NetQ13_1: Q13.1(D) R42.2
NetQ13_2: Q13.2(G) R41.1
NetR2_2: R2.2 U2.1(V+)
NetR4_2: R4.2 U2.3(S12)
NetR8_2: R8.2 U2.5(S11)
NetR11_2: R11.2 U2.7(S10)
NetR15_1: R15.1 U2.45(IBIAS)
NetR15_2: R15.2 R16.1 U2.46(ICMP)
NetR17_2: R17.2 U2.9(S9)
NetR20_2: R20.2 U2.11(S8)
NetR23_2: R23.2 U2.13(S7)
NetR26_2: R26.2 U2.15(S6)
NetR29_2: R29.2 U2.17(S5)
NetR32_2: R32.2 U2.19(S4)
NetR35_2: R35.2 U2.21(S3)
NetR38_2: R38.2 U2.23(S2)
NetR41_2: R41.2 U2.25(S1)

Not connected (* = marked no-connect by the designer): U1 4(NC) 5(NC) 6(IPA) 8(IMA) 9(IMA) 10(GND) 11(IPA) 12(NC) 13(NC) 15(NC); U2 27(GPIO1) 28(GPIO2) 29(GPIO3) 32(GPIO4) 33(GPIO5) 39(WDT); U8 4(NC) 5(NC)

### Layout directives
differential pair: isoSPI_N, isoSPI_P

### Notes on the sheet
- To test connector
- To LTC6811 #2
- To ultracapacitors
- To controller
- Document name:
- Project name:
- Date:
- Time:
- Drawn by:
- Validation
- Sheet
- University of Victoria
- 3800 Finnerty Road
- Victoria BC V8P 5C2
- CANADA
- of
- Revision:
- Size:
- A2

### Library data of the parts
C1-C36 = Cap: Capacitor; Published: 8-Jun-2000; LatestRevisionDate: 17-Jul-2002; LatestRevisionNote: Re-released for DXP Platform.; PackageReference: RAD-0.3; Publisher: Altium Limited; PackageDescription: Radial Cap, Thru-Hole; 2 Leads; 0.3 in Pin Spacing
  C1 C2: Supplier Part Number: 490-5402-1-ND
  C3-C16 C23-C36: Supplier Part Number: 399-3476-1-ND
  C17-C22: Supplier Part Number: 490-3296-1-ND
D1-D12 = D Zener: Zener Diode; Published: 8-Jun-2000; LatestRevisionDate: 17-Jul-2002; LatestRevisionNote: Re-released for DXP Platform.; PackageReference: DIODE-0.7; Publisher: Altium Limited; PackageDescription: Diode, Thru-Hole; 2 Leads; 0.7 in Pin Spacing; Supplier Part Number: 568-6455-1-ND
F1-F12 = Fuse 1: Fuse; Published: 8-Jun-2000; LatestRevisionDate: 17-Jul-2002; LatestRevisionNote: Re-released for DXP Platform.; PackageReference: PIN-W2/E2.8; Publisher: Altium Limited
  F1 F2 F5-F9 F11: Supplier Part Number: F5964CT-ND
Q1-Q4 Q6-Q13 = MOSFET-P: P-Channel MOSFET; Published: 8-Jun-2000; LatestRevisionDate: 17-Jul-2002; LatestRevisionNote: Re-released for DXP Platform.; PackageVersion: 1995/1996; PackageReference: E3; Publisher: Altium Limited; PackageDescription: TO, Flat Index; 3 In-Line, Axial Leads; Body Dia. 4.6mm; Lead Dia. 0.5 mm (max); Supplier Part Number: BSS308PE H6327CT-ND
Q5 = 2N3904: NPN General Purpose Amplifier; Published: 8-Jun-2000; LatestRevisionDate: 15-Jan-2003; LatestRevisionNote: PCB Footprint 'BCY-W3/D4.7' replaced; DatasheetVersion: 1997; PackageVersion: Sep-1998; PackageReference: TO-92A; Publisher: Altium Limited; PackageDescription: TO, Flat Index; 3 In-Line, Axial Leads; Body Dia. 4.5mm; Leads 0.51 x 0.48 mm (max); ComponentLink1Description: Manufacturer Link; ComponentLink1URL: http://www.fairchildsemi.com/; ComponentLink2Description: Datasheet; ComponentLink2URL: http://www.fairchildsemi.com/ds/2N%2F2N3904.pdf; Supplier Part Number: NSV1C201MZ4T1GOSCT-ND
R1-R42 = Res1: Resistor
  R1 R2: Published: 8-Jun-2000; LatestRevisionDate: 17-Jul-2002; LatestRevisionNote: Re-released for DXP Platform.; PackageReference: AXIAL-0.3; Publisher: Altium Limited; PackageDescription: Axial Device, Thru-Hole; 2 Leads; 0.3 in Pin Spacing; Supplier Part Number: P140HCT-ND
  R3 R6 R10 R14 R19 R22 R25 R28 R31 R34 R37 R40: Published: 8-Jun-2000; LatestRevisionDate: 17-Jul-2002; LatestRevisionNote: Re-released for DXP Platform.; PackageReference: AXIAL-0.3; Publisher: Altium Limited; PackageDescription: Axial Device, Thru-Hole; 2 Leads; 0.3 in Pin Spacing; Supplier Part Number: 311-100HRCT-ND
  R4 R8 R11 R17 R20 R23 R26 R29 R32 R35 R38 R41: Published: 8-Jun-2000; LatestRevisionDate: 17-Jul-2002; LatestRevisionNote: Re-released for DXP Platform.; PackageReference: AXIAL-0.3; Publisher: Altium Limited; PackageDescription: Axial Device, Thru-Hole; 2 Leads; 0.3 in Pin Spacing; Supplier Part Number: 311-3.30KHRCT-ND
  R5 R9 R12 R18 R21 R24 R27 R30 R33 R36 R39 R42: Published: 8-Jun-2000; LatestRevisionDate: 17-Jul-2002; LatestRevisionNote: Re-released for DXP Platform.; PackageReference: AXIAL-0.3; Publisher: Altium Limited; PackageDescription: Axial Device, Thru-Hole; 2 Leads; 0.3 in Pin Spacing; Supplier Part Number: RMCF2512FT12R0CT-ND
  R7: Published: 8-Jun-2000; LatestRevisionDate: 17-Jul-2002; LatestRevisionNote: Re-released for DXP Platform.; PackageReference: AXIAL-0.3; Publisher: Altium Limited; PackageDescription: Axial Device, Thru-Hole; 2 Leads; 0.3 in Pin Spacing; Supplier Part Number: 311-0.0JRTR-ND
  R13: Value: 120; Supplier Part Number: 311-120HRCT-ND
  R15 R16: Published: 8-Jun-2000; LatestRevisionDate: 17-Jul-2002; LatestRevisionNote: Re-released for DXP Platform.; PackageReference: AXIAL-0.3; Publisher: Altium Limited; PackageDescription: Axial Device, Thru-Hole; 2 Leads; 0.3 in Pin Spacing; Value: 1K; Supplier Part Number: 311-1.0KGRCT-ND
U8 = LM2931AD-5.0R2G: IC REG LINEAR 5V 100MA 8SOIC; Supplier Part Number: LM2931AD-5.0R2GOSCT-ND
U1 = TG110-AE050N5: Mouser Part Number: TG110-AE050N5

## Nets that join several sheets
5V: Controller (13 pins), IO (1.2)
GLV: Controller (21 pins), IO (8 pins)
TS-: Controller (C42.1 U5.9 U5.15), IO (P5.1), CellMonitor1 (19 pins)
ATMEGA_MISO: Controller (U5.6 U6.15 U7.16), IO (1.1)
ATMEGA_MOSI: Controller (U5.5 U6.14 U7.15), IO (1.4)
ATMEGA_SCK: Controller (U5.4 U6.13 U7.17), IO (1.3)
CAN_N: Controller (R47.1 U4.6), IO (P6.8)
CAN_P: Controller (R47.2 U4.7), IO (P6.9)
CS: Controller (U5.14), CellMonitor1 (U2.41)
NetC3_2: IO (P1.3), CellMonitor1 (6 pins)
NetC5_2: IO (P1.1), CellMonitor1 (6 pins)
NetF1_1: IO (P5.14), CellMonitor1 (F1.1)
NetF2_1: IO (P5.12), CellMonitor1 (F2.1)
NetF3_1: IO (P5.11), CellMonitor1 (F3.1)
NetF4_1: IO (P5.10), CellMonitor1 (F4.1)
NetF5_1: IO (P5.9), CellMonitor1 (F5.1)
NetF6_1: IO (P5.8), CellMonitor1 (F6.1)
NetF7_1: IO (P5.7), CellMonitor1 (F7.1)
NetF8_1: IO (P5.6), CellMonitor1 (F8.1)
NetF9_1: IO (P5.5), CellMonitor1 (F9.1)
NetF10_1: IO (P5.4), CellMonitor1 (F10.1)
NetF11_1: IO (P5.3), CellMonitor1 (F11.1)
NetF12_1: IO (P5.2), CellMonitor1 (F12.1)
NetP1_2: IO (P1.2), CellMonitor1 (R7.2 U2.4)
NetP2_1: Controller (U7.2), IO (P2.1)
NetP2_2: Controller (U7.10), IO (P2.2)
NetP2_3: Controller (U7.11), IO (P2.3)
NetP3_1: IO (P3.1), CellMonitor1 (U1.16)
NetP3_2: IO (P3.2), CellMonitor1 (U1.14)
NetP6_6: Controller (U7.24), IO (P6.6)
NetP6_7: Controller (U7.23), IO (P6.7)
NetP6_10: Controller (Q14.1 R45.2), IO (P6.10)
NetP7_1: Controller (U7.31), IO (P7.1)
NetP7_2: Controller (U7.30), IO (P7.2)
RBRB: Controller (C37.2 Q14.3 R43.2 U3.1), IO (P6.11 P6.12)
RESET: Controller (R50.1 SW1.1 U7.29), IO (1.5)
SCK: Controller (U5.13), CellMonitor1 (U2.42)
SDI: Controller (U5.12), CellMonitor1 (U2.43)
SDO: Controller (U5.11), CellMonitor1 (U2.44)
TS_5V: Controller (C42.2 U5.10 U5.16), CellMonitor1 (U8.1)